# Altium schematic sheet Sheet1.SchDoc
size A1
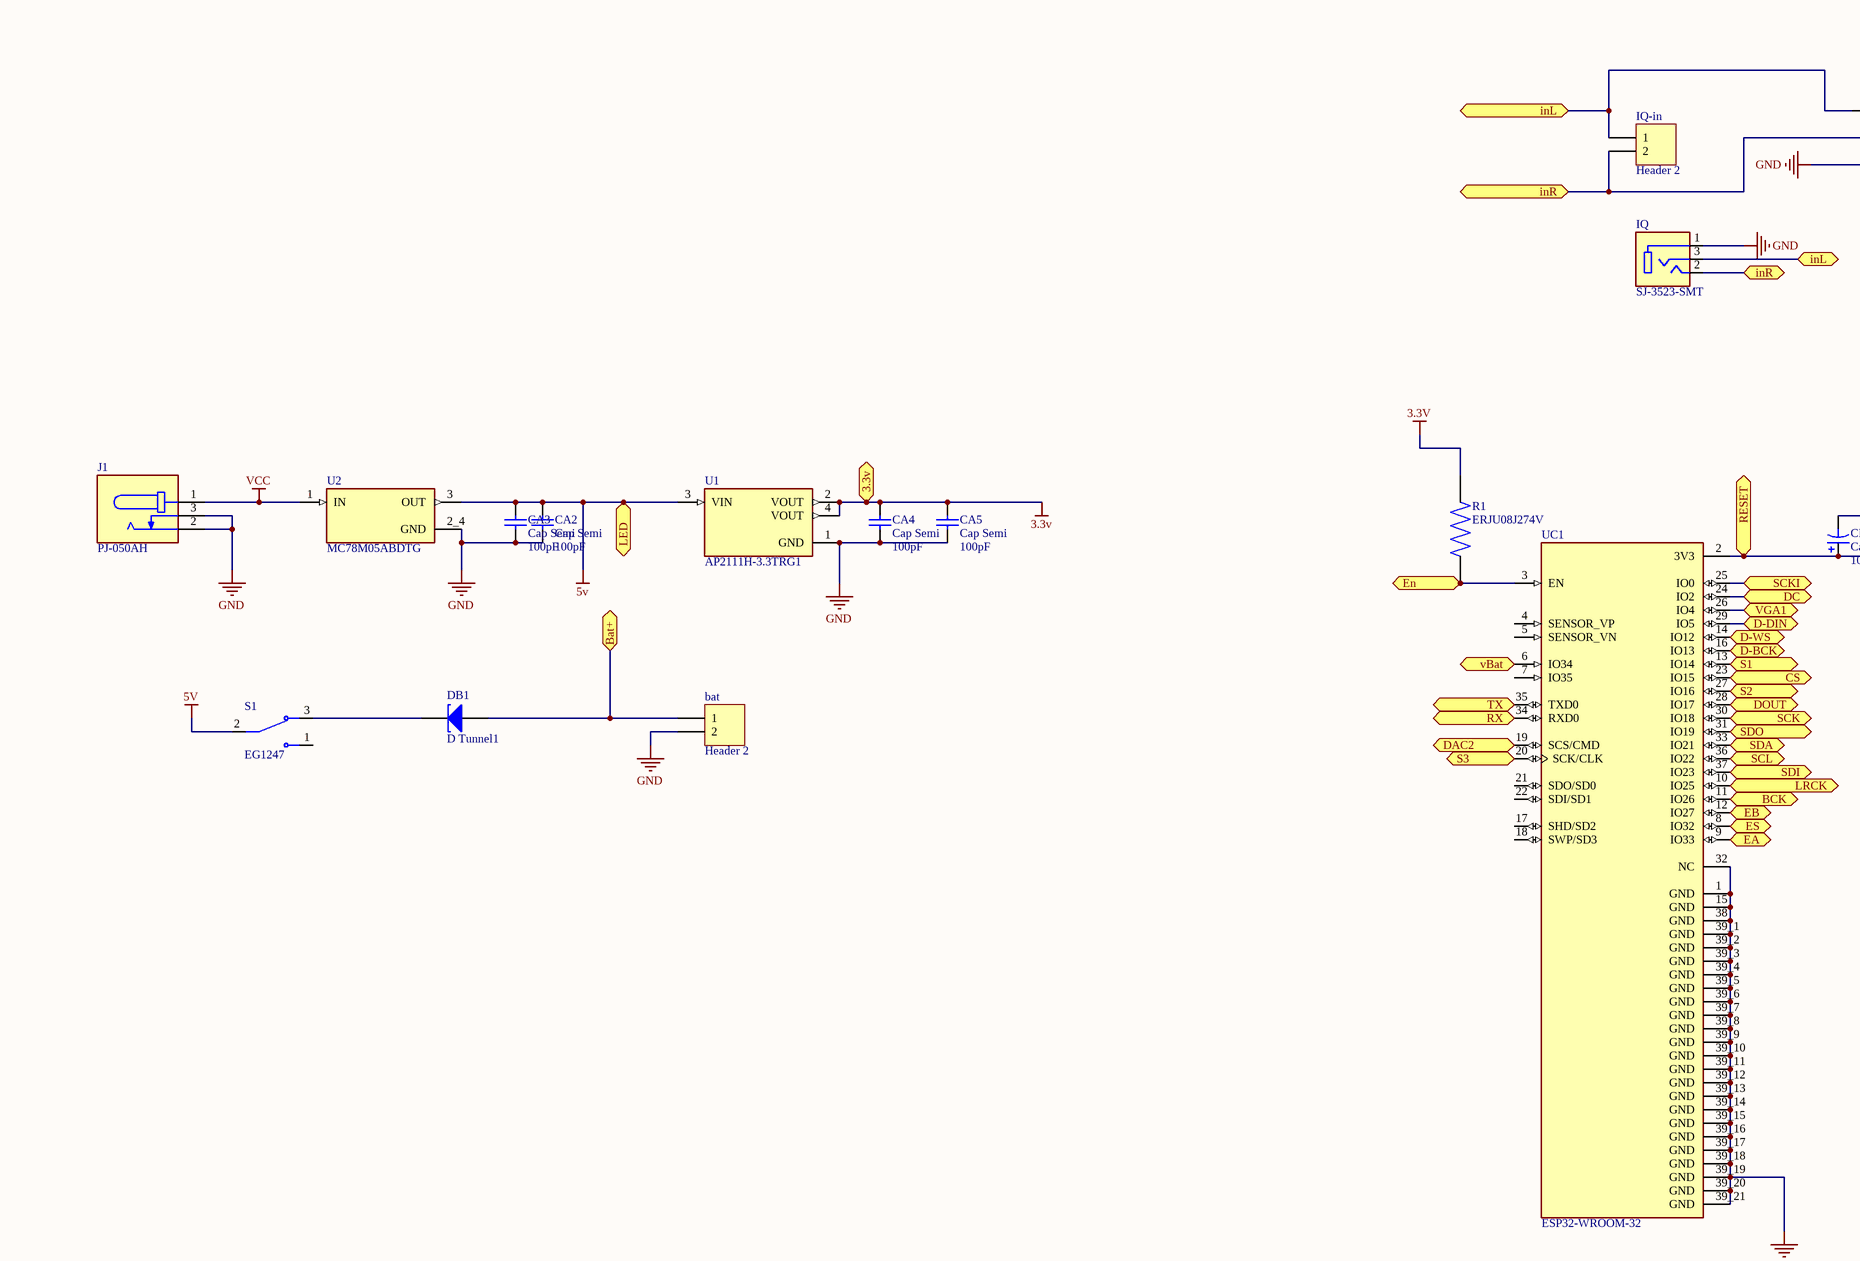
[diagram p0: Sheet1.SchDoc, top left]
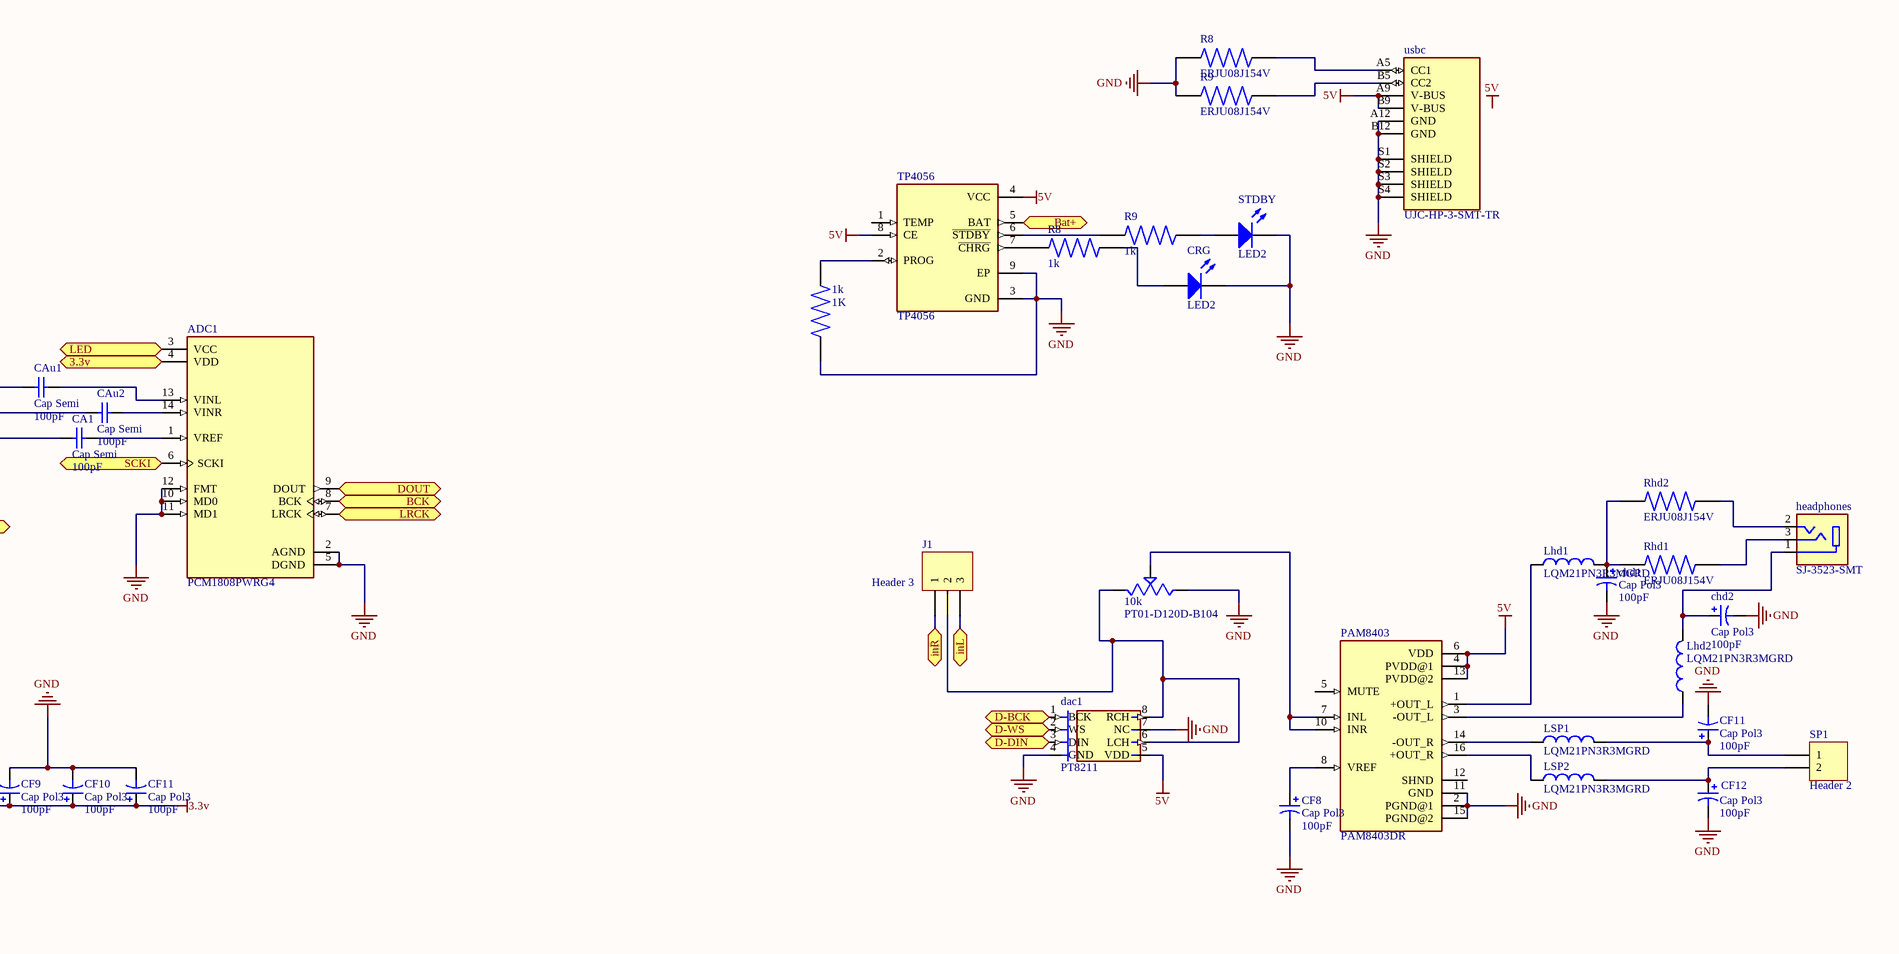
[diagram p1: Sheet1.SchDoc, top right]
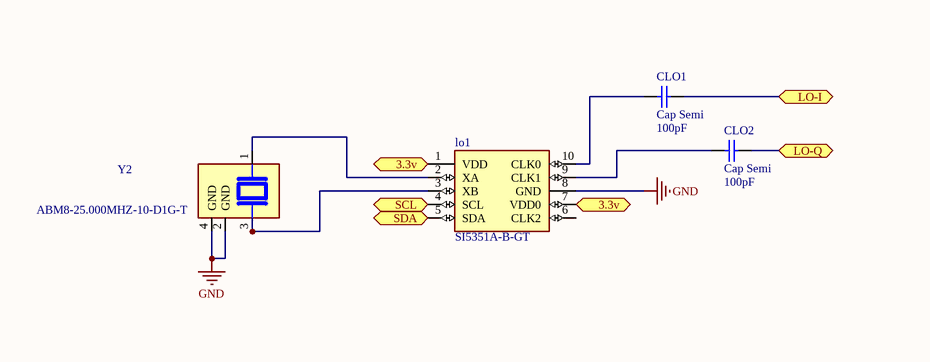
[diagram p2: Sheet1.SchDoc, bottom left]
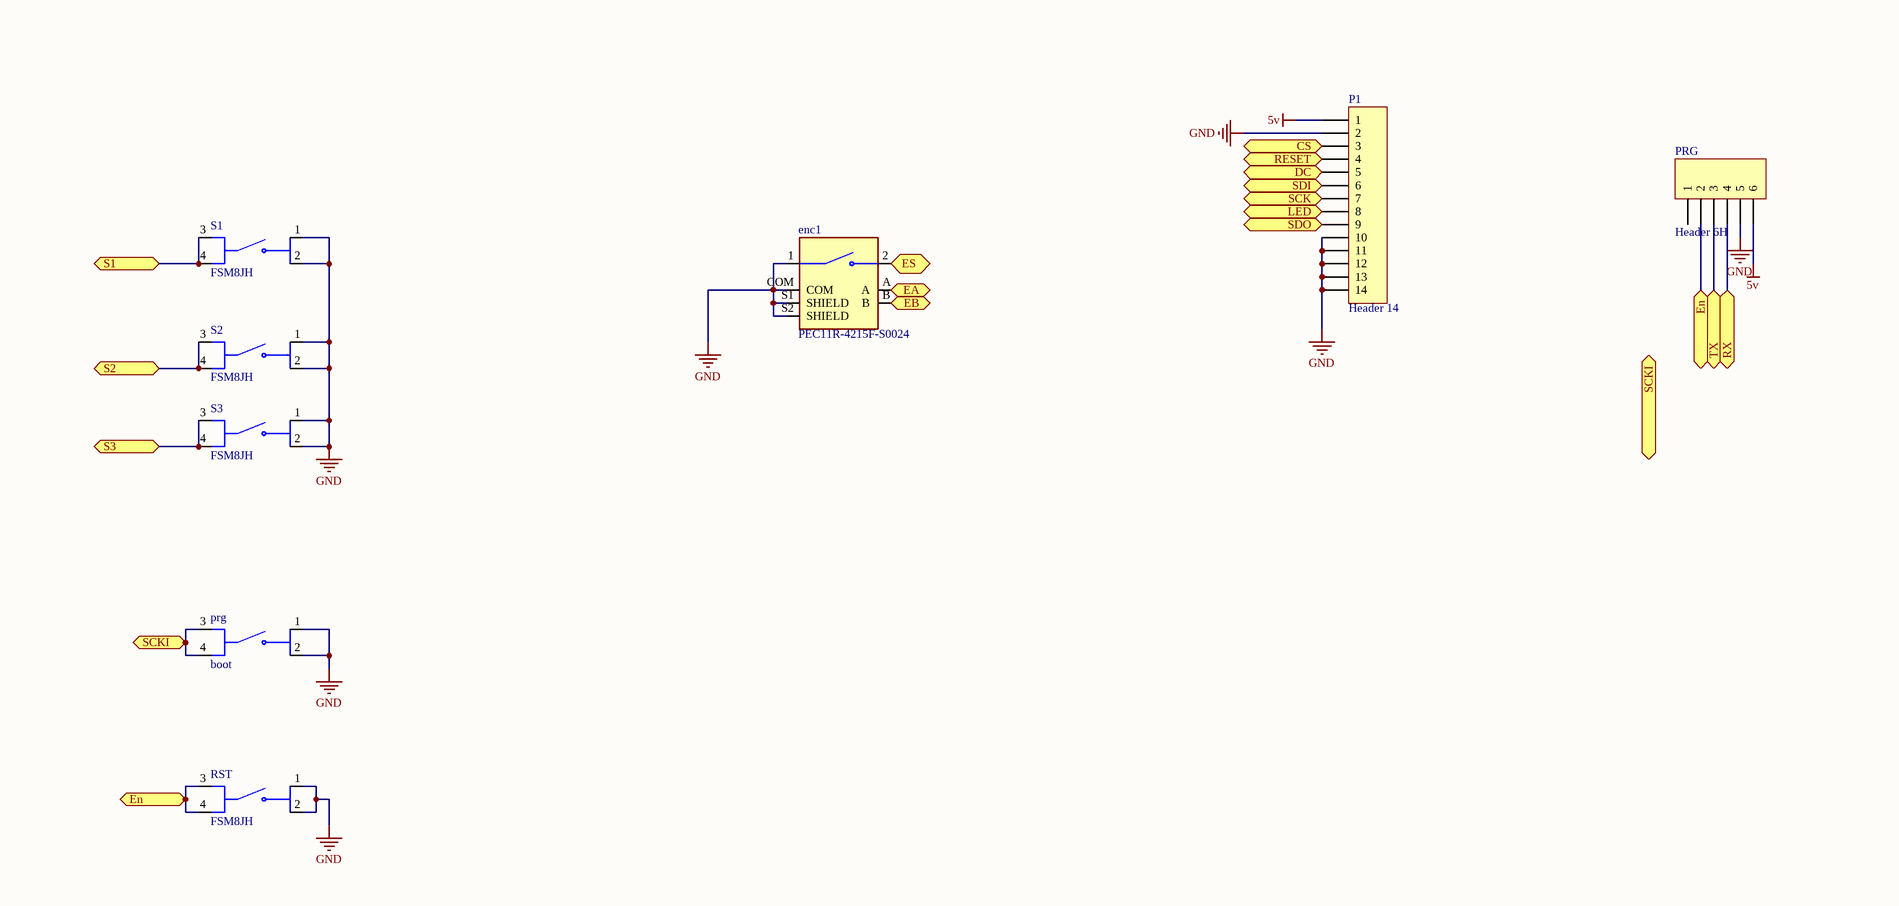
[diagram p3: Sheet1.SchDoc, bottom right]

## Parts
(Parts that share a designator on the sheet are numbered #1, #2 ... from top to bottom, then left to right.)
1k  1K  [RES_ERJU08J274V]
10k  PT01-D120D-B104  [TRIM_PT01-D120D-B104]
ADC1  PCM1808PWRG4  [SOP65P640X120-14N]
bat  Header 2  [HDR1X2]
CA1  Cap Semi  value 100pF  [C1206]
CA2  Cap Semi  value 100pF  [C1206]
CA3  Cap Semi  value 100pF  [C1206]
CA4  Cap Semi  value 100pF  [C1206]
CA5  Cap Semi  value 100pF  [C1206]
CAu1  Cap Semi  value 100pF  [C1206]
CAu2  Cap Semi  value 100pF  [C1206]
CF8  Cap Pol3  value 100pF  [C0805]
CF9  Cap Pol3  value 100pF  [C0805]
CF10  Cap Pol3  value 100pF  [C0805]
CF11#1  Cap Pol3  value 100pF  [C0805]
CF11#2  Cap Pol3  value 100pF  [C0805]
CF12  Cap Pol3  value 100pF  [C0805]
chd1  Cap Pol3  value 100pF  [C0805]
chd2  Cap Pol3  value 100pF  [C0805]
CLO1  Cap Semi  value 100pF  [C1206]
CLO2  Cap Semi  value 100pF  [C1206]
CRG  LED2  [3.2X1.6X1.1]
dac1  PT8211  [SOP8-6.0-4.9X3.9]
DB1  D Tunnel1  [3.2X1.6X1.1]
enc1  PEC11R-4215F-S0024  [XDCR_PEC11R-4215F-S0024]
headphones  SJ-3523-SMT  [CUI_SJ-3523-SMT]
IQ  SJ-3523-SMT  [CUI_SJ-3523-SMT]
IQ-in  Header 2  [HDR1X2]
J1#1  Header 3  [HDR1X3]
J1#2  PJ-050AH  [CUI_PJ-050AH]
Lhd1  LQM21PN3R3MGRD  [INDC2012X100N]
Lhd2  LQM21PN3R3MGRD  [INDC2012X100N]
lo1  SI5351A-B-GT  [SOP50P490X110-10N]
LSP1  LQM21PN3R3MGRD  [INDC2012X100N]
LSP2  LQM21PN3R3MGRD  [INDC2012X100N]
P1  Header 14  [HDR1X14]
PAM8403  PAM8403DR  [SOIC127P605X150-16N]
PRG#1  Header 6H  [HDR1X6H]
prg#2  boot  [SW_FSM8JH]
R1  ERJU08J274V  [RES_ERJU08J274V]
R8#1  ERJU08J154V  [RES_ERJU08J154V]
R8#2  1k  [RES_ERJU08J274V]
R9#1  ERJU08J154V  [RES_ERJU08J154V]
R9#2  1k  [RES_ERJU08J274V]
Rhd1  ERJU08J154V  [RES_ERJU08J154V]
Rhd2  ERJU08J154V  [RES_ERJU08J154V]
RST  FSM8JH  [SW_FSM8JH]
S1#1  EG1247  [SW_EG1247]
S1#2  FSM8JH  [SW_FSM8JH]
S2  FSM8JH  [SW_FSM8JH]
S3  FSM8JH  [SW_FSM8JH]
SP1  Header 2  [HDR1X2]
STDBY  LED2  [3.2X1.6X1.1]
TP4056  TP4056  [SOP127P600X175-9N]
U1  AP2111H-3.3TRG1  [SOT230P700X180-4N]
U2  MC78M05ABDTG  [VREG_MC78M05ABDTG]
UC1  ESP32-WROOM-32  [MODULE_ESP32-WROOM-32]
usbc  UJC-HP-3-SMT-TR  [CUI_UJC-HP-3-SMT-TR]
Y2  ABM8-25.000MHZ-10-D1G-T  [XTAL_ABM8-25.000MHZ-10-D1G-T]

## Ports
3.3v, Bat+, BCK, CS, D-BCK, D-DIN, D-WS, DAC2, DC, DOUT, EA, EB, En, ES, inL, inR, LED, LO-I, LO-Q, LRCK, RESET, RX, S1, S2, S3, SCK, SCKI, SCL, SDA, SDI, SDO, TX, vBat, VGA1

## Nets
3.3v: ADC1.4(VDD) CA4.2 CA5.2 CF9.1 CF10.1 CF11#2.1 lo1.1(VDD) lo1.7(VDD0) P1.4 R1.2 U1.2(VOUT) U1.4(VOUT) UC1.2(3V3) ; port RESET, port 3.3v
5v: ADC1.3(VCC) CA2.2 CA3.2 dac1.5(VDD) P1.1 P1.8 PAM8403.4(PVDD@1) PAM8403.6(VDD) PAM8403.13(PVDD@2) PRG#1.6 S1#1.2 TP4056.4(VCC) TP4056.8(CE) U1.3(VIN) U2.3(OUT) usbc.A9(V-BUS) usbc.B9(V-BUS) ; port LED
GND: 1k.1 10k.3 ADC1.2(AGND) ADC1.5(DGND) ADC1.10(MD0) ADC1.11(MD1) ADC1.12(FMT) bat.2 CA1.1 CA2.1 CA3.1 CA4.1 CA5.1 CF8.2 CF9.2 CF10.2 CF11#1.2 CF11#2.2 CF12.2 chd1.2 chd2.2 CRG.2(K) dac1.4(GND) dac1.7(NC) enc1.1 enc1.COM enc1.S1(SHIELD) enc1.S2(SHIELD) IQ.1 J1#2.2 J1#2.3 lo1.8(GND) P1.2 P1.10 P1.11 P1.12 P1.13 P1.14 PAM8403.2(PGND@1) PAM8403.11(GND) PAM8403.15(PGND@2) PRG#1.5 prg#2.1(NO_1) prg#2.2(NO_2) R8#1.1 R9#1.1 RST.1(NO_1) RST.2(NO_2) S1#2.1(NO_1) S1#2.2(NO_2) S2.1(NO_1) S2.2(NO_2) S3.1(NO_1) S3.2(NO_2) STDBY.2(K) TP4056.3(GND) TP4056.9(EP) U1.1(GND) U2.2_4(GND) UC1.1(GND) UC1.15(GND) UC1.32(NC) UC1.38(GND) UC1.39_1(GND) UC1.39_2(GND) UC1.39_3(GND) UC1.39_4(GND) UC1.39_5(GND) UC1.39_6(GND) UC1.39_7(GND) UC1.39_8(GND) UC1.39_9(GND) UC1.39_10(GND) UC1.39_11(GND) UC1.39_12(GND) UC1.39_13(GND) UC1.39_14(GND) UC1.39_15(GND) UC1.39_16(GND) UC1.39_17(GND) UC1.39_18(GND) UC1.39_19(GND) UC1.39_20(GND) UC1.39_21(GND) usbc.A12(GND) usbc.B12(GND) usbc.S1(SHIELD) usbc.S2(SHIELD) usbc.S3(SHIELD) usbc.S4(SHIELD) Y2.2(GND) Y2.4(GND)
VCC: J1#2.1 U2.1(IN)
Bat+: bat.1 DB1.1(A) TP4056.5(BAT) ; port Bat+
BCK: ADC1.8(BCK) UC1.11(IO26) ; port BCK
CS: P1.3 UC1.23(IO15) ; port CS
D-BCK: dac1.1(BCK) UC1.16(IO13) ; port D-BCK
D-DIN: dac1.3(DIN) UC1.29(IO5) ; port D-DIN
D-WS: dac1.2(WS) UC1.14(IO12) ; port D-WS
DAC2: UC1.19(SCS/CMD) ; port DAC2
DC: P1.5 UC1.24(IO2) ; port DC
DOUT: ADC1.9(DOUT) UC1.28(IO17) ; port DOUT
EA: enc1.A UC1.9(IO33) ; port EA
EB: enc1.B UC1.12(IO27) ; port EB
En: PRG#1.2 R1.1 RST.3(COM_3) RST.4(COM_4) UC1.3(EN) ; port En
ES: enc1.2 UC1.8(IO32) ; port ES
inL: CAu1.2 IQ.3 IQ-in.1 J1#1.3 ; port inL
inR: CAu2.2 IQ.2 IQ-in.2 J1#1.1 ; port inR
LO-I: CLO1.2 ; port LO-I
LO-Q: CLO2.2 ; port LO-Q
LRCK: ADC1.7(LRCK) UC1.10(IO25) ; port LRCK
RX: PRG#1.4 UC1.34(RXD0) ; port RX
S1: S1#2.3(COM_3) S1#2.4(COM_4) UC1.13(IO14) ; port S1
S2: S2.3(COM_3) S2.4(COM_4) UC1.27(IO16) ; port S2
S3: S3.3(COM_3) S3.4(COM_4) UC1.20(SCK/CLK) ; port S3
SCK: P1.7 UC1.30(IO18) ; port SCK
SCKI: ADC1.6(SCKI) prg#2.3(COM_3) prg#2.4(COM_4) UC1.25(IO0) ; port SCKI
SCL: lo1.4(SCL) UC1.36(IO22) ; port SCL
SDA: lo1.5(SDA) UC1.33(IO21) ; port SDA
SDI: P1.6 UC1.37(IO23) ; port SDI
SDO: P1.9 UC1.31(IO19) ; port SDO
TX: PRG#1.3 UC1.35(TXD0) ; port TX
vBat: UC1.6(IO34) ; port vBat
VGA1: UC1.26(IO4) ; port VGA1
Net1k_2: 1k.2 TP4056.2(PROG)
Net10k_1: 10k.1 dac1.6(LCH) dac1.8(RCH) J1#1.2
Net10k_2: 10k.2 PAM8403.7(INL) PAM8403.10(INR)
NetADC1_1: ADC1.1(VREF) CA1.2
NetADC1_13: ADC1.13(VINL) CAu1.1
NetADC1_14: ADC1.14(VINR) CAu2.1
NetCF8_1: CF8.1 PAM8403.8(VREF)
NetCF11#1_1: CF11#1.1 LSP1.2 SP1.1
NetCF12_1: CF12.1 LSP2.2 SP1.2
Netchd1_1: chd1.1 Lhd1.2 Rhd1.1 Rhd2.1
Netchd2_1: chd2.1 headphones.1 Lhd2.2
NetCLO1_1: CLO1.1 lo1.10(CLK0)
NetCLO2_1: CLO2.1 lo1.9(CLK1)
NetCRG_1: CRG.1(A) R8#2.1
NetDB1_2: DB1.2(K) S1#1.3
Netheadphones_2: headphones.2 Rhd2.2
Netheadphones_3: headphones.3 Rhd1.2
NetLhd1_1: Lhd1.1 PAM8403.1(+OUT_L)
NetLhd2_1: Lhd2.1 PAM8403.3(-OUT_L)
Netlo1_2: lo1.2(XA) Y2.1
Netlo1_3: lo1.3(XB) Y2.3
NetLSP1_1: LSP1.1 PAM8403.14(-OUT_R)
NetLSP2_1: LSP2.1 PAM8403.16(+OUT_R)
NetR8#1_2: R8#1.2 usbc.A5(CC1)
NetR8#2_2: R8#2.2 TP4056.7(~{CHRG})
NetR9#1_2: R9#1.2 usbc.B5(CC2)
NetR9#2_1: R9#2.1 STDBY.1(A)
NetR9#2_2: R9#2.2 TP4056.6(~{STDBY})

Not connected (* = marked no-connect by the designer): lo1 6(CLK2); PAM8403 5(MUTE) 12(SHND); PRG#1 1; S1#1 1; TP4056 1(TEMP); UC1 4(SENSOR_VP) 5(SENSOR_VN) 7(IO35) 17(SHD/SD2) 18(SWP/SD3) 21(SDO/SD0) 22(SDI/SD1)

## Notes on the sheet
- Labels drawn without touching a wire or pin: 5V

## Library data of the parts
1k R8#2 R9#2 = ERJU08J274V: MP: ERJU08J274V; Availability: Unavailable; Package: None; Value: *; Price: None
10k = PT01-D120D-B104: 10 mm, Vertical, Linear, 100 kÎ©, Through Hole, D-cut Rotary Potentiometer; MF: Same Sky; SnapEDA_Link: https://www.snapeda.com/parts/PT01-D120D-B104/Same+Sky/view-part/?ref=snap; Package: None; Value: *; MP: PT01-D120D-B104; Check_prices: https://www.snapeda.com/parts/PT01-D120D-B104/Same+Sky/view-part/?ref=eda
ADC1 = PCM1808PWRG4: 99dB SNR Stereo ADC With Single-Ended Inputs 14-TSSOP -40 to 85; MF: Texas Instruments; SnapEDA_Link: https://www.snapeda.com/parts/PCM1808PWRG4/Texas+Instruments/view-part/?ref=snap; Package: TSSOP-14 Texas Instruments; Value: *; MP: PCM1808PWRG4; Check_prices: https://www.snapeda.com/parts/PCM1808PWRG4/Texas+Instruments/view-part/?ref=eda
bat IQ-in SP1 = Header 2: Header, 2-Pin; LatestRevisionDate: 17-Jul-2002; LatestRevisionNote: Re-released for DXP Platform.; Publisher: Altium Limited
CA1-CA5 CAu1 CAu2 CLO1 CLO2 = Cap Semi: Capacitor (Semiconductor SIM Model); Published: 8-Jun-2000; LatestRevisionDate: 29-May-2009; LatestRevisionNote: IPC-7351 Footprint Added.; PackageReference: C1206; Publisher: Altium Limited; PackageDescription: Chip Capacitor
CF8-CF10 CF11#1 CF11#2 CF12 chd1 chd2 = Cap Pol3: Polarized Capacitor (Surface Mount); Published: 8-Jun-2000; LatestRevisionDate: 29-May-2009; LatestRevisionNote: IPC-7351 Footprint Added.; PackageReference: C0805; Publisher: Altium Limited; PackageDescription: Chip Capacitor
CRG STDBY = LED2: Typical RED, GREEN, YELLOW, AMBER GaAs LED; Published: 8-Jun-2000; LatestRevisionDate: 17-Jul-2002; LatestRevisionNote: Re-released for DXP Platform.; PackageVersion: Feb-2002; PackageReference: 3.2X1.6X1.1; Publisher: Altium Limited; PackageDescription: SM LED; 2 Flat Leads
dac1 = PT8211: 8 Pin, DIP, 300mil; MF: Princeton Technology; SnapEDA_Link: https://www.snapeda.com/parts/PT8211/Princeton+Technology/view-part/?ref=snap; Package: Package; Value: *; MP: PT8211; Check_prices: https://www.snapeda.com/parts/PT8211/Princeton+Technology/view-part/?ref=eda
DB1 = D Tunnel1: Tunnel Diode - RLC Model; Published: 8-Jun-2000; LatestRevisionDate: 17-Jul-2002; LatestRevisionNote: Re-released for DXP Platform.; PackageVersion: Feb-2002; PackageReference: 3.2X1.6X1.1; Publisher: Altium Limited; PackageDescription: SM LED; 2 Flat Leads
enc1 = PEC11R-4215F-S0024: Incremental Encoder, 12 Mm, Contact Rating 10 Ma - 5 Vdc; Price: None; Availability: Unavailable; MP: PEC11R-4215F-S0024; Value: *; Package: None
headphones IQ = SJ-3523-SMT: 3.50mm (0.141, 1/8, Mini Plug) - Headphone Phone Jack Stereo (3 Conductor, TRS) Connector Solder; MF: Same Sky; SnapEDA_Link: https://www.snapeda.com/parts/SJ-3523-SMT/Same+Sky/view-part/?ref=snap; Package: None; Value: *; MP: SJ-3523-SMT; Check_prices: https://www.snapeda.com/parts/SJ-3523-SMT/Same+Sky/view-part/?ref=eda
J1#1 = Header 3: Header, 3-Pin; LatestRevisionDate: 17-Jul-2002; LatestRevisionNote: Re-released for DXP Platform.; Publisher: Altium Limited
J1#2 = PJ-050AH: 2.0 x 6.0 mm, 5.0 A, Horizontal, Through Hole, Pick-n-Place Top, Dc Power Jack Connector; MF: Same Sky; SnapEDA_Link: https://www.snapeda.com/parts/PJ-050AH/Same+Sky/view-part/?ref=snap; Package: None; Value: *; MP: PJ-050AH; Check_prices: https://www.snapeda.com/parts/PJ-050AH/Same+Sky/view-part/?ref=eda
Lhd1 Lhd2 LSP1 LSP2 = LQM21PN3R3MGRD: 0805 Multillayer Type (Ferrite Core) for Power lines; Package: None; Price: None; Value: *; MP: LQM21PN3R3MGRD; Availability: Unavailable
lo1 = SI5351A-B-GT: I2C Prog, Any Frequency, Any Output, Xtal Ref, 3-Output LVCMOS Clock Gen; MF: Skyworks Solutions; MP: SI5351ABGT; SnapEDA_Link: https://www.snapeda.com/parts/SI5351ABGT/Skyworks+Solutions/view-part/?ref=snap; Package: None; Value: *; Check_prices: https://www.snapeda.com/parts/SI5351ABGT/Skyworks+Solutions/view-part/?ref=eda
P1 = Header 14: Header, 14-Pin; LatestRevisionDate: 17-Jul-2002; LatestRevisionNote: Re-released for DXP Platform.; Publisher: Altium Limited
PAM8403 = PAM8403DR: Amplifier IC 2-Channel _Stereo_ Class D 16-SOP; MF: Diodes Inc.; MP: PAM8403DR; Availability: Unavailable; Package: SOP-16 Diodes Inc.; Value: *; Price: None; SnapEDA_Link: https://www.snapeda.com/parts/PAM8403DR/Diodes%20Inc./view-part/108087/?ref=snap
PRG#1 = Header 6H: Header, 6-Pin, Right Angle; LatestRevisionDate: 17-Jul-2002; LatestRevisionNote: Re-released for DXP Platform.; Publisher: Altium Limited
prg#2 RST S1#2 S2 S3 = FSM8JH: Switch,Pushbutton,Tactile,SPST,Thru Hole,Vertical,6MM,Black | TE Connectivity FSM8JH; SnapEDA_Link: https://www.snapeda.com/parts/FSM8JH/TE+Connectivity+ALCOSWITCH+Switches/view-part/?ref=snap; Package: None; Value: *; MF: TE Connectivity; MP: FSM8JH; Check_prices: https://www.snapeda.com/parts/FSM8JH/TE+Connectivity+ALCOSWITCH+Switches/view-part/?ref=eda
R8#1 R9#1 Rhd1 Rhd2 = ERJU08J154V: 1206 anti-sulfurated resistor 1206 Anti-Sulfurated; MF: Panasonic; MP: ERJ-U08J154V; SnapEDA_Link: https://www.snapeda.com/parts/ERJ-U08J154V/Panasonic/view-part/?ref=snap; Package: 3216-2 Panasonic; Value: *; Check_prices: https://www.snapeda.com/parts/ERJ-U08J154V/Panasonic/view-part/?ref=eda
S1#1 = EG1247: Slide Switch SPDT Through Hole, Right Angle; MF: E-Switch; Availability: In Stock; Value: *; Price: None; Check_prices: https://www.snapeda.com/parts/EG1247/E-Switch/view-part/?ref=eda; Purchase-URL: https://pricing.snapeda.com/search/part/EG1247/?ref=eda; SnapEDA_Link: https://www.snapeda.com/parts/EG1247/E-Switch/view-part/?ref=snap; MP: EG1247; Package: None
TP4056 = TP4056: Complete single cell Li-Ion battery with a constant current / constant voltage linear charger; MF: NanJing Top Power ASIC Corp.; Check_prices: https://www.snapeda.com/parts/TP4056/NanJing+Top+Power+ASIC+Corp./view-part/?ref=eda; SnapEDA_Link: https://www.snapeda.com/parts/TP4056/NanJing+Top+Power+ASIC+Corp./view-part/?ref=snap; Price: None; Availability: Not in stock; Package: Package; MP: TP4056; Value: *
U1 = AP2111H-3.3TRG1: Voltage Regulators, LDO, 600mA CMOS LDO 50mA 3.3V 250mV | Diodes Inc AP2111H-3.3TRG1; MF: Diodes Inc.; SnapEDA_Link: https://www.snapeda.com/parts/AP2111H-3.3TRG1/Diodes+Inc./view-part/?ref=snap; Package: SOT-223 Diodes Inc.; Value: *; MP: AP2111H-3.3TRG1; Check_prices: https://www.snapeda.com/parts/AP2111H-3.3TRG1/Diodes+Inc./view-part/?ref=eda
U2 = MC78M05ABDTG: MF: {'manufacturer': u'onsemi'}; Package: None; Price: None; Value: *; MP: MC78M05ABDTG; Availability: Unavailable
UC1 = ESP32-WROOM-32: Bluetooth, WiFi 802.11b/g/n, Bluetooth v4.2 +EDR, Class 1, 2 and 3 Transceiver Module 2.4GHz ~ 2.5GHz Antenna Not Included, U.FL Surface Mount; MF: Espressif Systems; Price: None; Availability: In Stock; MP: ESP32-WROOM-32; Package: Module Espressif Systems; SnapEDA_Link: https://www.snapeda.com/parts/ESP32-WROOM-32/Espressif+Systems/view-part/?ref=snap; Check_prices: https://www.snapeda.com/parts/ESP32-WROOM-32/Espressif+Systems/view-part/?ref=eda; Value: *; Purchase-URL: https://pricing.snapeda.com/search/part/ESP32-WROOM-32/?ref=eda
Y2 = ABM8-25.000MHZ-10-D1G-T: 25 MHz Â±10ppm Crystal 10pF 50 Ohms 4-SMD, No Lead; MF: Abracon LLC; SnapEDA_Link: https://www.snapeda.com/parts/ABM8-25.000MHZ-10-D1G-T/Abracon/view-part/?ref=snap; Package: NON-STANDARD-4 ABRACON; Value: *; MP: ABM8-25.000MHZ-10-D1G-T; Check_prices: https://www.snapeda.com/parts/ABM8-25.000MHZ-10-D1G-T/Abracon/view-part/?ref=eda
R1 = ERJU08J274V: MP: ERJU08J274V; Availability: Unavailable; Package: None; Value: *; Price: None
usbc = UJC-HP-3-SMT-TR: Package: None; Price: None; Value: *; MP: UJC-HP-3-SMT-TR; Availability: Unavailable